# Altium schematic sheet Sheet1.SchDoc
size A; SheetNumber: 1; SheetTotal: 1; SPICEModelCacheLFFBLBRH: <root> / <DocumentId>LFFBLBRH</DocumentId> / <CacheFrame Number="0"> / <Model Name="led1" Kind="MDL"> / <Text>*Typ RED GaAs LED: Vf=1.7V Vr=4V If=40mA trr=3uS / *LED Pinout: 1=A, 2=K / .MODEL LED1 D (IS=93.2P RS=42M N=3.73 BV=4 IBV=10U / + CJO=2.97P VJ=.75 M=.333 TT=4.32U)</Text> / </Model> / </CacheFrame> / </root>
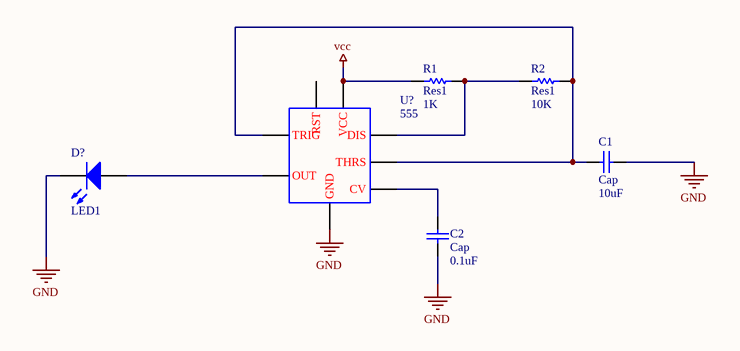
[diagram p0: Sheet1.SchDoc]

## Parts
C1  Cap  value 10uF  [RAD-0.3]
C2  Cap  value 0.1uF  [RAD-0.3]
D?  LED1  [LED-1]
R1  Res1  value 1K  [AXIAL-0.3]
R2  Res1  value 10K  [AXIAL-0.3]
U?  555

## Nets
GND: C1.2 C2.2 D?.2(K) U?.1(GND)
vcc: R1.1 U?.8(VCC)
NetC1_1: C1.1 R2.2 U?.2(TRIG) U?.6(THRS)
NetC2_1: C2.1 U?.5(CV)
NetD?_1: D?.1(A) U?.3(OUT)
NetR1_2: R1.2 R2.1 U?.7(DIS)

Not connected (* = marked no-connect by the designer): U? 4(RST)

## Library data of the parts
C1 C2 = Cap: Capacitor; Published: 8-Jun-2000; LatestRevisionDate: 17-Jul-2002; LatestRevisionNote: Re-released for DXP Platform.; PackageReference: RAD-0.3; Publisher: Altium Limited; PackageDescription: Radial Cap, Thru-Hole; 2 Leads; 0.3 in Pin Spacing
D? = LED1: Typical RED GaAs LED; Published: 8-Jun-2000; LatestRevisionDate: 08-Jul-2005; LatestRevisionNote: Mech Layer 1 removed.; PackageReference: LED-1; Publisher: Altium Limited; PackageDescription: LED; 2 Leads
R1 R2 = Res1: Resistor; Published: 8-Jun-2000; LatestRevisionDate: 17-Jul-2002; LatestRevisionNote: Re-released for DXP Platform.; PackageReference: AXIAL-0.3; Publisher: Altium Limited; PackageDescription: Axial Device, Thru-Hole; 2 Leads; 0.3 in Pin Spacing
U? = 555: Timer 555; SimulationGenericComponent: True